# EAGLE design base (EAGLE 9.1.2)
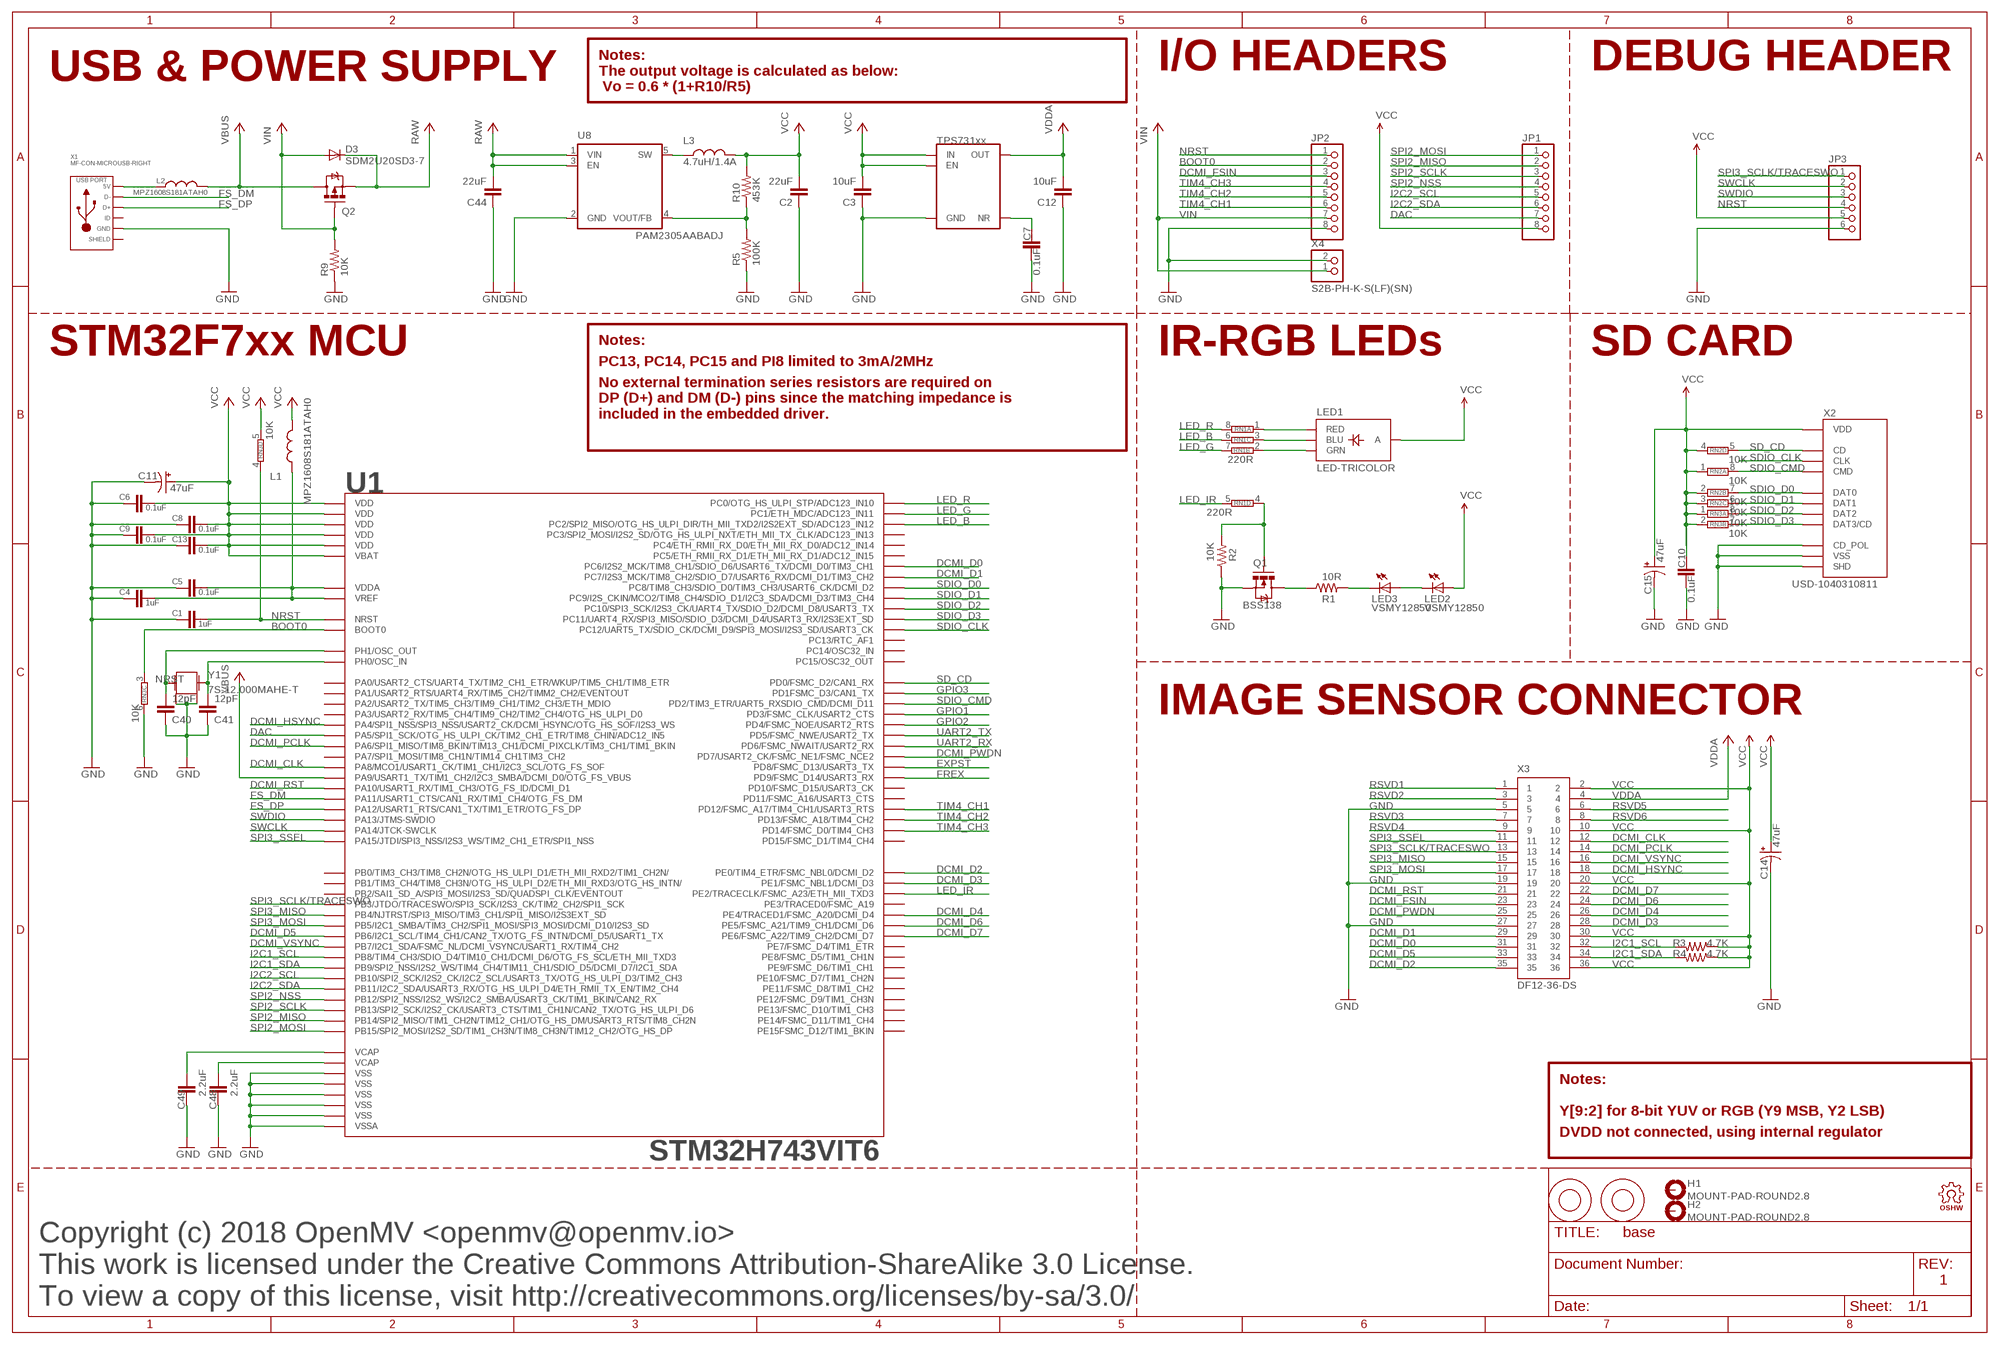
[diagram p0: schematic, sheet 1]

## Parts
C1  1uF  CAP0603-CAP  [0603-CAP]
C2  22uF  CAP0805  [0805]
C3  10uF  CAP0805  [0805]
C4  1uF  CAP0603-CAP  [0603-CAP]
C5  0.1uF  CAP0603-CAP  [0603-CAP]
C6  0.1uF  CAP0603-CAP  [0603-CAP]
C7  0.1uF  CAP0603-CAP  [0603-CAP]
C8  0.1uF  CAP0603-CAP  [0603-CAP]
C9  0.1uF  CAP0603-CAP  [0603-CAP]
C10  0.1uF  CAP0603-CAP  [0603-CAP]
C11  47uF  CAP_POL1206  [EIA3216]
C12  10uF  CAP0805  [0805]
C13  0.1uF  CAP0603-CAP  [0603-CAP]
C14  47uF  CAP_POL1206  [EIA3216]
C15  47uF  CAP_POL1206  [EIA3216]
C40  12pF  CAP0603-CAP  [0603-CAP]
C41  12pF  CAP0603-CAP  [0603-CAP]
C44  22uF  CAP0805  [0805]
C48  2.2uF  CAP0603-CAP  [0603-CAP]
C49  2.2uF  CAP0603-CAP  [0603-CAP]
D3  SDM2U20SD3-7  DIODESOD  [SOD-323]
H1  MOUNT-PAD-ROUND2.8  [2,8-PAD]
H2  MOUNT-PAD-ROUND2.8  [2,8-PAD]
JP1  PINHD-1X8  [1X08]
JP2  PINHD-1X8  [1X08]
JP3  PINHD-1X6  [1X06]
L1  MPZ1608S181ATAH0  INDUCTOR0603  [0603]
L2  MPZ1608S181ATAH0  INDUCTOR0603  [0603]
L3  4.7uH/1.4A  INDUCTOR1007  [1007]
LED1  LED-TRICOLOR  [LED-TRICOLOR-SMD-MF]
LED2  VSMY12850  LED1206  [LED-1206]
LED3  VSMY12850  LED1206  [LED-1206]
LOGO1  OSHW_LOGO_FILLX0100-NT  [OSHW_FILLX100_NOTEXT]
M1  9774030243R  9774030151R  [9774030151R]
M2  9774030243R  9774030151R  [9774030151R]
Q1  BSS138  MOSFET-NCHANNELSMD  [SOT23-3]
Q2  Si2301BDS  MOSFET-PCHANNELSMD  [SOT23-3]
R1  10R  RESISTOR0603-RES  [0603-RES]
R2  10K  RESISTOR0603-RES  [0603-RES]
R3  4.7K  RESISTOR0603-RES  [0603-RES]
R4  4.7K  RESISTOR0603-RES  [0603-RES]
R5  100K  RESISTOR0603-RES  [0603-RES]
R9  10K  RESISTOR0603-RES  [0603-RES]
R10  453K  RESISTOR0603-RES  [0603-RES]
RN1  220R  4R-NEXBV8V  [EXBV8V]
RN2  10K  4R-NEXBV8V  [EXBV8V]
RN3  10K  4R-NEXBV8V  [EXBV8V]
U1  STM32H743VIT6  STM32F746LQFP100  [LQFP100]
U5  TPS731XX  [SOT23-5]
U8  PAM2305AABADJ  PAM2305AAB330  [TSOT25]
X1  MF-CON-MICROUSB-RIGHT  USB_MICRO_RIGHT  [MICROUSB-RIGHT]
X2  USD-1040310811  [1040310811]
X3  DF12-36-DS  [DF12-36-DS]
X4  S2B-PH-K-S(LF)(SN)  JST_2PIN-THM-RA  [JST-PH-2-THM-RA]
Y1  7S-12.000MAHE-T  CRYSTAL2.5X2.0  [CRYSTAL-2.5X2.0]

## Nets
BOOT0: JP2.2 RN3.3 U1.94(BOOT0)
DAC: JP1.7 U1.29(PA5/SPI1_SCK/OTG_HS_ULPI_CK/TIM2_CH1_ETR/TIM8_CHIN/ADC12_IN5)
DCMI_CLK: U1.67(PA8/MCO1/USART1_CK/TIM1_CH1/I2C3_SCL/OTG_FS_SOF) X3.12
DCMI_D0: U1.63(PC6/I2S2_MCK/TIM8_CH1/SDIO_D6/USART6_TX/DCMI_D0/TIM3_CH1) X3.31
DCMI_D1: U1.64(PC7/I2S3_MCK/TIM8_CH2/SDIO_D7/USART6_RX/DCMI_D1/TIM3_CH2) X3.29
DCMI_D2: U1.97(PE0/TIM4_ETR/FSMC_NBL0/DCMI_D2) X3.35
DCMI_D3: U1.98(PE1/FSMC_NBL1/DCMI_D3) X3.28
DCMI_D4: U1.3(PE4/TRACED1/FSMC_A20/DCMI_D4) X3.26
DCMI_D5: U1.92(PB6/I2C1_SCL/TIM4_CH1/CAN2_TX/OTG_FS_INTN/DCMI_D5/USART1_TX) X3.33
DCMI_D6: U1.4(PE5/FSMC_A21/TIM9_CH1/DCMI_D6) X3.24
DCMI_D7: U1.5(PE6/FSMC_A22/TIM9_CH2/DCMI_D7) X3.22
DCMI_FSIN: JP2.3 X3.23
DCMI_HSYNC: U1.28(PA4/SPI1_NSS/SPI3_NSS/USART2_CK/DCMI_HSYNC/OTG_HS_SOF/I2S3_WS) X3.18
DCMI_PCLK: U1.30(PA6/SPI1_MISO/TIM8_BKIN/TIM13_CH1/DCMI_PIXCLK/TIM3_CH1/TIM1_BKIN) X3.14
DCMI_PWDN: U1.88(PD7/USART2_CK/FSMC_NE1/FSMC_NCE2) X3.25
DCMI_RST: U1.69(PA10/USART1_RX/TIM1_CH3/OTG_FS_ID/DCMI_D1) X3.21
DCMI_VSYNC: U1.93(PB7/I2C1_SDA/FSMC_NL/DCMI_VSYNC/USART1_RX/TIM4_CH2) X3.16
EXPST: U1.55(PD8/FSMC_D13/USART3_TX)
FREX: U1.56(PD9/FSMC_D14/USART3_RX)
FS_DM: U1.70(PA11/USART1_CTS/CAN1_RX/TIM1_CH4/OTG_FS_DM) X1.2(D-)
FS_DP: U1.71(PA12/USART1_RTS/CAN1_TX/TIM1_ETR/OTG_FS_DP) X1.3(D+)
GND: C1.2 C2.1 C3.1 C4.2 C5.2 C6.2 C7.2 C8.2 C9.2 C10.2 C11.C(-) C12.1 C13.2 C14.C(-) C15.C(-) C40.1 C41.1 C44.1 C48.2 C49.2 JP2.8 JP3.6 Q1.2(S) R2.1 R5.1 R9.1 RN3.6 U1.10(VSS) U1.19(VSSA) U1.26(VSS) U1.49(VSS) U1.74(VSS) U1.99(VSS) U5.2(GND) U8.2(GND) X1.5(GND) X2.CD$2(CD_POL) X2.G$1(SHD) X2.G$2(SHD) X2.G$3(SHD) X2.G$4(SHD) X2.P$6(VSS) X3.5 X3.19 X3.27 X4.2 Y1.2 Y1.4
GPIO1: U1.84(PD3/FSMC_CLK/USART2_CTS)
GPIO2: U1.85(PD4/FSMC_NOE/USART2_RTS)
GPIO3: U1.82(PD1FSMC_D3/CAN1_TX)
I2C1_SCL: R3.2 U1.95(PB8/TIM4_CH3/SDIO_D4/TIM10_CH1/DCMI_D6/OTG_FS_SCL/ETH_MII_TXD3) X3.32
I2C1_SDA: R4.2 U1.96(PB9/SPI2_NSS/I2S2_WS/TIM4_CH4/TIM11_CH1/SDIO_D5/DCMI_D7/I2C1_SDA) X3.34
I2C2_SCL: JP1.5 U1.46(PB10/SPI2_SCK/I2S2_CK/I2C2_SCL/USART3_TX/OTG_HS_ULPI_D3/TIM2_CH3)
I2C2_SDA: JP1.6 U1.47(PB11/I2C2_SDA/USART3_RX/OTG_HS_ULPI_D4/ETH_RMII_TX_EN/TIM2_CH4)
LED_B: RN1.6 U1.17(PC2/SPI2_MISO/OTG_HS_ULPI_DIR/TH_MII_TXD2/I2S2EXT_SD/ADC123_IN12)
LED_G: RN1.7 U1.16(PC1/ETH_MDC/ADC123_IN11)
LED_IR: RN1.5 U1.1(PE2/TRACECLK/FSMC_A23/ETH_MII_TXD3)
LED_R: RN1.8 U1.15(PC0/OTG_HS_ULPI_STP/ADC123_IN10)
N$2: C40.2 U1.13(PH1/OSC_OUT) Y1.3
N$4: C41.2 U1.12(PH0/OSC_IN) Y1.1
N$5: Q1.1(G) R2.2 RN1.4
N$6: LED1.B(BLU) RN1.3
N$7: L2.1 X1.1(5V)
N$8: LED1.R(RED) RN1.1
N$9: LED1.G(GRN) RN1.2
N$10: LED3.C R1.2
N$11: C7.1 U5.4(NR)
N$12: C4.1 C5.1 L1.1 U1.20(VREF) U1.21(VDDA)
N$13: R5.2 R10.1 U8.4(VOUT/FB)
N$14: Q1.3(D) R1.1
N$17: LED2.C LED3.A
NRST: C1.1 JP2.1 JP3.4 RN3.4 U1.14(NRST)
RAW: C44.2 D3.1(C) Q2.2(S) U8.1(VIN) U8.3(EN)
RSVD1: X3.1
RSVD2: X3.3
RSVD3: X3.7
RSVD4: X3.9
RSVD5: X3.6
RSVD6: X3.8
SD_CD: RN2.5 U1.81(PD0/FSMC_D2/CAN1_RX) X2.CD$1(CD)
SDIO_CLK: U1.80(PC12/UART5_TX/SDIO_CK/DCMI_D9/SPI3_MOSI/I2S3_SD/USART3_CK) X2.P$5(CLK)
SDIO_CMD: RN2.8 U1.83(PD2/TIM3_ETR/UART5_RXSDIO_CMD/DCMI_D11) X2.P$3(CMD)
SDIO_D0: RN2.7 U1.65(PC8/TIM8_CH3/SDIO_D0/TIM3_CH3/USART6_CK/DCMI_D2) X2.P$7(DAT0)
SDIO_D1: RN2.6 U1.66(PC9/I2S_CKIN/MCO2/TIM8_CH4/SDIO_D1/I2C3_SDA/DCMI_D3/TIM3_CH4) X2.P$8(DAT1)
SDIO_D2: RN3.8 U1.78(PC10/SPI3_SCK/I2S3_CK/UART4_TX/SDIO_D2/DCMI_D8/USART3_TX) X2.P$1(DAT2)
SDIO_D3: RN3.7 U1.79(PC11/UART4_RX/SPI3_MISO/SDIO_D3/DCMI_D4/USART3_RX/I2S3EXT_SD) X2.P$2(DAT3/CD)
SPI2_MISO: JP1.2 U1.53(PB14/SPI2_MISO/TIM1_CH2N/TIM12_CH1/OTG_HS_DM/USART3_RTS/TIM8_CH2N)
SPI2_MOSI: JP1.1 U1.54(PB15/SPI2_MOSI/I2S2_SD/TIM1_CH3N/TIM8_CH3N/TIM12_CH2/OTG_HS_DP)
SPI2_NSS: JP1.4 U1.51(PB12/SPI2_NSS/I2S2_WS/I2C2_SMBA/USART3_CK/TIM1_BKIN/CAN2_RX)
SPI2_SCLK: JP1.3 U1.52(PB13/SPI2_SCK/I2S2_CK/USART3_CTS/TIM1_CH1N/CAN2_TX/OTG_HS_ULPI_D6)
SPI3_MISO: U1.90(PB4/NJTRST/SPI3_MISO/TIM3_CH1/SPI1_MISO/I2S3EXT_SD) X3.15
SPI3_MOSI: U1.91(PB5/I2C1_SMBA/TIM3_CH2/SPI1_MOSI/SPI3_MOSI/DCMI_D10/I2S3_SD) X3.17
SPI3_SCLK/TRACESWO: JP3.1 U1.89(PB3/JTDO/TRACESWO/SPI3_SCK/I2S3_CK/TIM2_CH2/SPI1_SCK) X3.13
SPI3_SSEL: U1.77(PA15/JTDI/SPI3_NSS/I2S3_WS/TIM2_CH1_ETR/SPI1_NSS) X3.11
SW: L3.1 U8.5(SW)
SWCLK: JP3.2 U1.76(PA14/JTCK-SWCLK)
SWDIO: JP3.3 U1.72(PA13/JTMS-SWDIO)
TIM4_CH1: JP2.6 U1.59(PD12/FSMC_A17/TIM4_CH1/USART3_RTS)
TIM4_CH2: JP2.5 U1.60(PD13/FSMC_A18/TIM4_CH2)
TIM4_CH3: JP2.4 U1.61(PD14/FSMC_D0/TIM4_CH3)
UART2_RX: U1.87(PD6/FSMC_NWAIT/USART2_RX)
UART2_TX: U1.86(PD5/FSMC_NWE/USART2_TX)
VBUS: L2.2 Q2.3(D) U1.68(PA9/USART1_TX/TIM1_CH2/I2C3_SMBA/DCMI_D0/OTG_FS_VBUS)
VCAP1: C49.1 U1.48(VCAP)
VCAP2: C48.1 U1.73(VCAP)
VCC: C2.2 C3.2 C6.1 C8.1 C9.1 C10.1 C11.A(+) C13.1 C14.A(+) C15.A(+) JP1.8 JP3.5 L1.2 L3.2 LED1.A LED2.A R3.1 R4.1 R10.2 RN2.1 RN2.2 RN2.3 RN2.4 RN3.1 RN3.2 RN3.5 U1.6(VBAT) U1.11(VDD) U1.27(VDD) U1.50(VDD) U1.75(VDD) U1.100(VDD) U5.1(IN) U5.3(EN) X2.P$4(VDD) X3.2 X3.10 X3.20 X3.30 X3.36
VDDA: C12.2 U5.5(OUT) X3.4
VIN: D3.2(A) JP2.7 Q2.1(G) R9.2 X4.1
Unconnected: H1.B2,8(MOUNT) H2.B2,8(MOUNT) U1.2(PE3/TRACED0/FSMC_A19) U1.7(PC13/RTC_AF1) U1.8(PC14/OSC32_IN) U1.9(PC15/OSC32_OUT) U1.18(PC3/SPI2_MOSI/I2S2_SD/OTG_HS_ULPI_NXT/ETH_MII_TX_CLK/ADC123_IN13) U1.22(PA0/USART2_CTS/UART4_TX/TIM2_CH1_ETR/WKUP/TIM5_CH1/TIM8_ETR) U1.23(PA1/USART2_RTS/UART4_RX/TIM5_CH2/TIMM2_CH2/EVENTOUT) U1.24(PA2/USART2_TX/TIM5_CH3/TIM9_CH1/TIM2_CH3/ETH_MDIO) U1.25(PA3/USART2_RX/TIM5_CH4/TIM9_CH2/TIM2_CH4/OTG_HS_ULPI_D0) U1.31(PA7/SPI1_MOSI/TIM8_CH1N/TIM14_CH1TIM3_CH2) U1.32(PC4/ETH_RMII_RX_D0/ETH_MII_RX_D0/ADC12_IN14) U1.33(PC5/ETH_RMII_RX_D1/ETH_MII_RX_D1/ADC12_IN15) U1.34(PB0/TIM3_CH3/TIM8_CH2N/OTG_HS_ULPI_D1/ETH_MII_RXD2/TIM1_CH2N/) U1.35(PB1/TIM3_CH4/TIM8_CH3N/OTG_HS_ULPI_D2/ETH_MII_RXD3/OTG_HS_INTN/) U1.36(PB2/SAI1_SD_A/SPI3_MOSI/I2S3_SD/QUADSPI_CLK/EVENTOUT) U1.37(PE7/FSMC_D4/TIM1_ETR) U1.38(PE8/FSMC_D5/TIM1_CH1N) U1.39(PE9/FSMC_D6/TIM1_CH1) U1.40(PE10/FSMC_D7/TIM1_CH2N) U1.41(PE11/FSMC_D8/TIM1_CH2) U1.42(PE12/FSMC_D9/TIM1_CH3N) U1.43(PE13/FSMC_D10/TIM1_CH3) U1.44(PE14/FSMC_D11/TIM1_CH4) U1.45(PE15FSMC_D12/TIM1_BKIN) U1.57(PD10/FSMC_D15/USART3_CK) U1.58(PD11/FSMC_A16/USART3_CTS) U1.62(PD15/FSMC_D1/TIM4_CH4) X1.4(ID) X1.S1(SLD) X1.S2(SLD) X1.S3(SLD) X1.S4(SLD) X1.S5(SLD) X1.S6(SLD)

## Notes on the sheet
- Notes:
- USB & POWER SUPPLY | I/O HEADERS | DEBUG HEADER
- The output voltage is calculated as below:
   Vo = 0.6 * (1+R10/R5)
- Notes:
- STM32F7xx MCU | IR-RGB LEDs | SD CARD
- PC13, PC14, PC15 and PI8 limited to 3mA/2MHz
- No external termination series resistors are required on
  DP (D+) and DM (D-) pins since the matching impedance is
  included in the embedded driver.
- IMAGE SENSOR CONNECTOR
- Notes:
- Y[9:2] for 8-bit YUV or RGB (Y9 MSB, Y2 LSB)
- DVDD not connected, using internal regulator
- Copyright (c) 2018 OpenMV <openmv@openmv.io>
- This work is licensed under the Creative Commons Attribution-ShareAlike 3.0 License.
- 1
- To view a copy of this license, visit http://creativecommons.org/licenses/by-sa/3.0/

## Library data of the parts
C1-C10 C12 C13 C40 C41 C44 C48 C49 = sfe:CAP: Capacitor Standard 0603 ceramic capacitor, and 0.1" leaded capacitor.
C11 C14 C15 = sfe:CAP_POL: Capacitor Polarized These are standard SMD and PTH capacitors. Normally 10uF, 47uF, and 100uF in electrolytic and tantalum varieties. Always verify the external diameter of the through hole cap, it varies with capacity, voltage, and manufacturer. The EIA devices should be standard.
D3 = sfe:DIODE: Diode These are standard reverse protection diodes and small signal diodes. SMA package can handle up to about 1A. SOD-323 can handle about 200mA. What the SOD-323 package when ordering, there are some mfgs out there that are 5-pin packages.
H1 H2 = holes:MOUNT-PAD-ROUND: MOUNTING PAD, round
JP1 JP2 = pinhead:PINHD-1X8: PIN HEADER
JP3 = pinhead:PINHD-1X6: PIN HEADER
L1-L3 = sfe:INDUCTOR: Inductors Basic Inductor/Choke - 0603 and 1206. Footprints are not proven and vary greatly between part numbers.
LED1 = sfe:LED-TRICOLOR: Tri-Color LED SMD Proven layout and schematic for triple color LED in SMD package - common anode. Spark Fun Electronics SKU : COM-07844
LED2 LED3 = sfe:LED: LEDs Standard schematic elements and footprints for 5mm, 3mm, 1206, and 0603 sized LEDs. 5mm - Spark Fun Electronics SKU : COM-00529 (and others)
LOGO1 = iofault:OSHW_LOGO_FILL
M1 M2 = STANDOFFS:9774030151R
Q1 = sfe:MOSFET-NCHANNEL
Q2 = sfe:MOSFET-PCHANNEL
R1-R5 R9 R10 = sfe:RESISTOR: Resistor Basic schematic elements and footprints for 0603, 1206, and PTH resistors.
RN1-RN3 = resistor-dil:4R-N: Array Chip Resistor Source: RS Component / Phycomp; OC_FARNELL: unknown; OC_NEWARK: unknown
U1 = stm32:STM32F746
U5 = mux:TPS731XX
U8 = regulators:PAM2305AAB330
X1 = MF_Connectors:USB: Library: MF_Connectors Description: 5 Pin USB Connectors. SLD is the shield connection. Usually tied to ground through a small ferrite bead.
X2 = molex:USD-1040310811
X3 = DF12:DF12-36-DS
X4 = adafruit-updated:JST_2PIN: JST 2-Pin Connectors of various flavors SMT-RA (S2B-PH-SM4) 4UConnector #17311 SMT (B2B-PH-SM4) THM-RA (S2B-PH) THM (B2B-PH)
Y1 = mux:CRYSTAL: Crystals Various standard crystals. Proven footprints. Spark Fun Electronics SKU : COM-00534

## Board
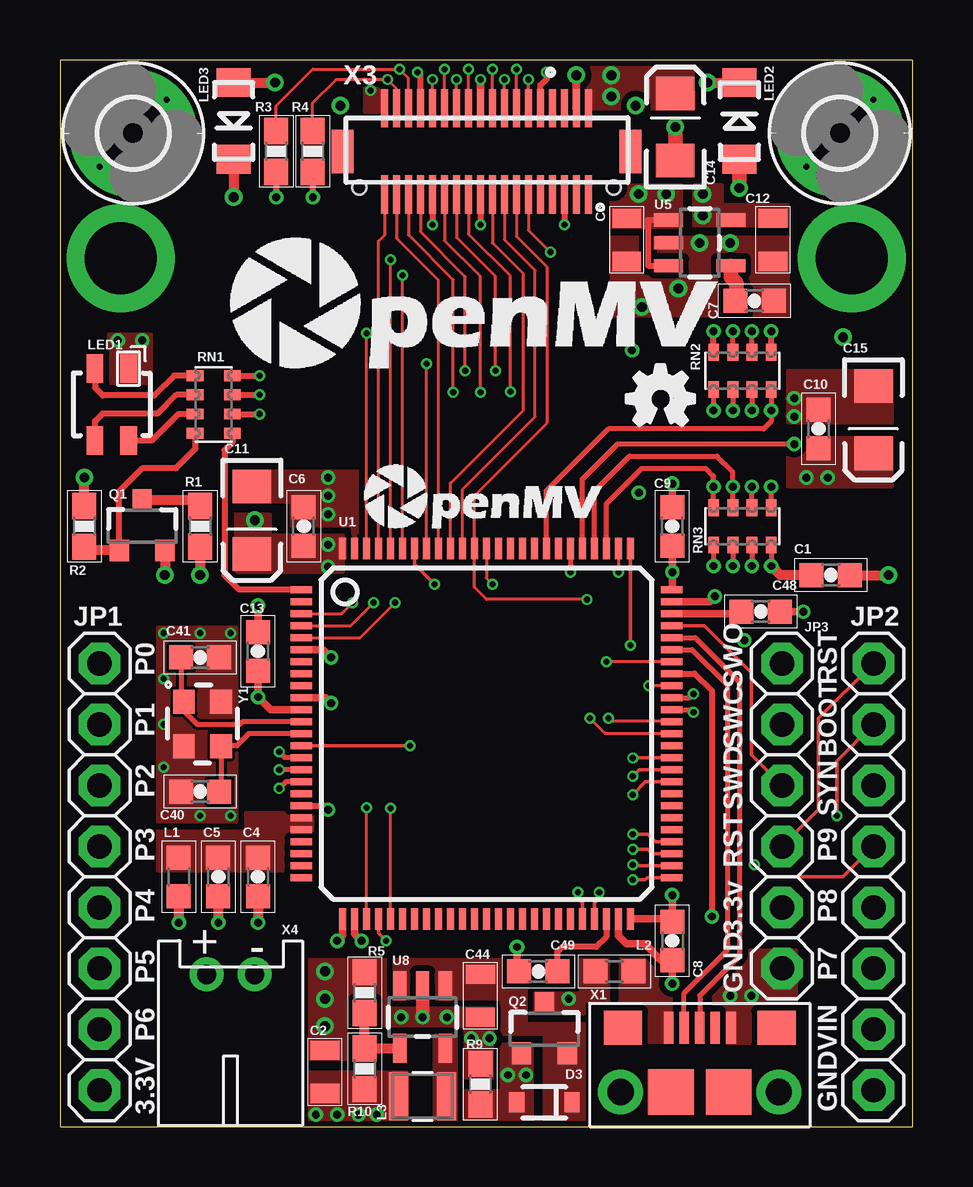
[diagram p1: board, top side]
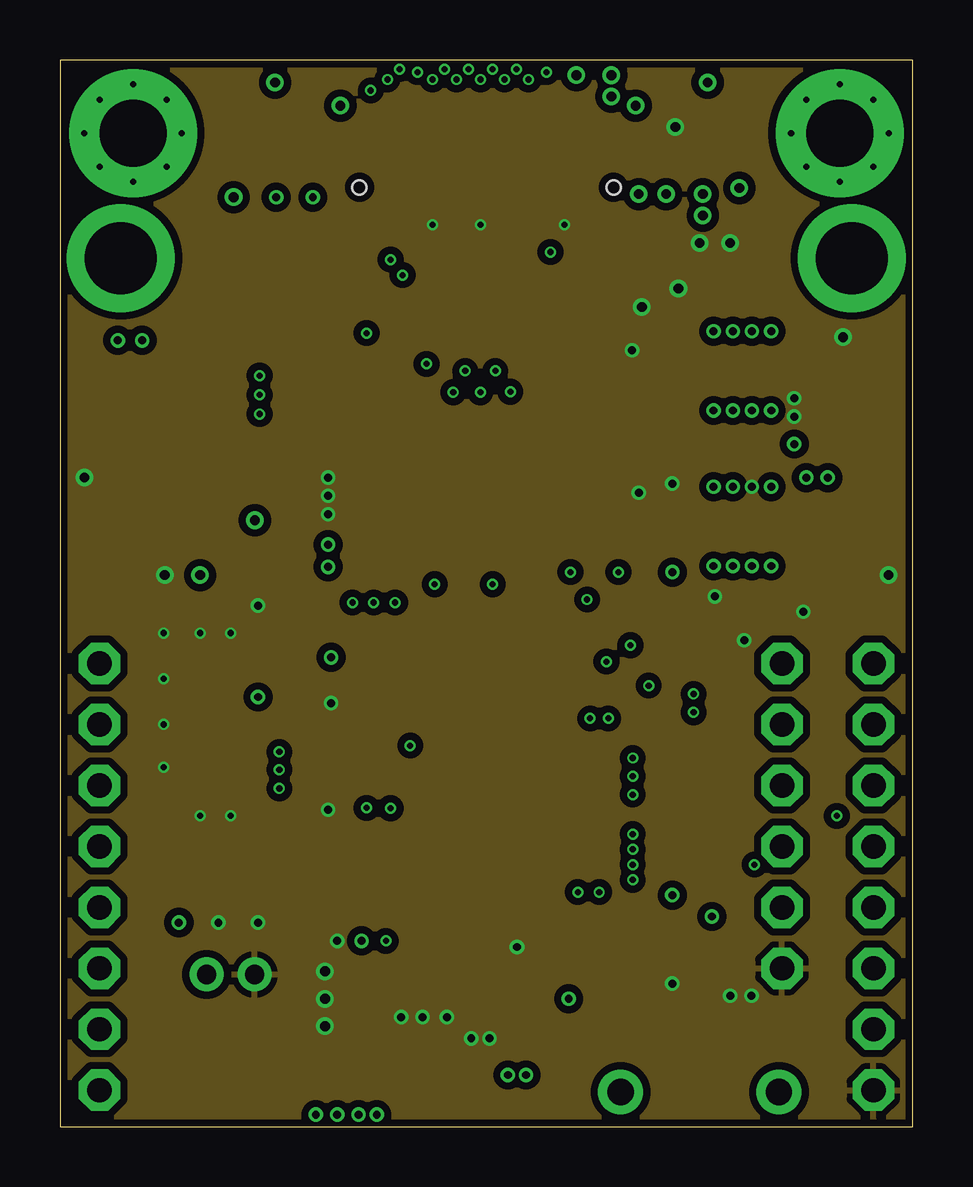
[diagram p2: board, inner layer GND]
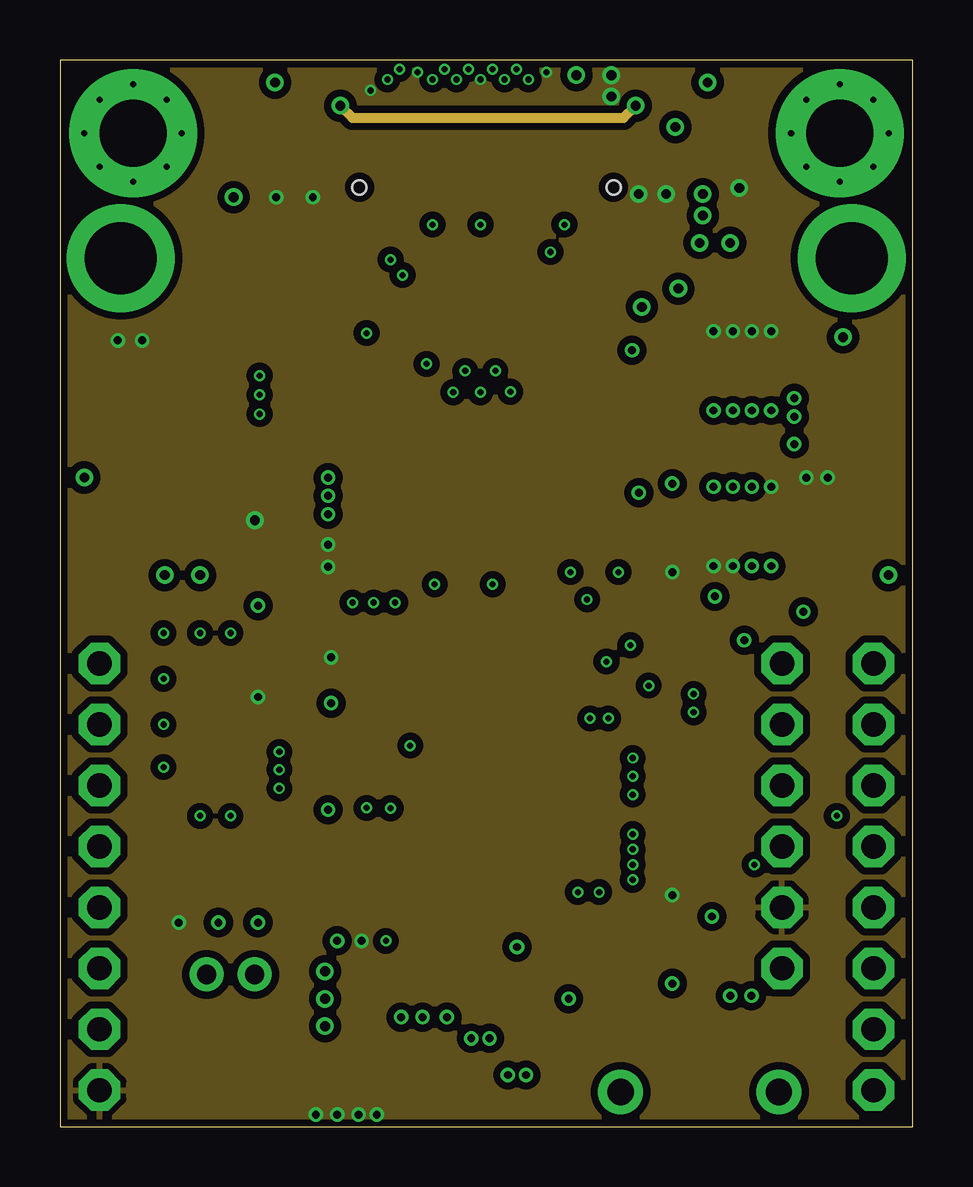
[diagram p3: board, inner layer VCC]
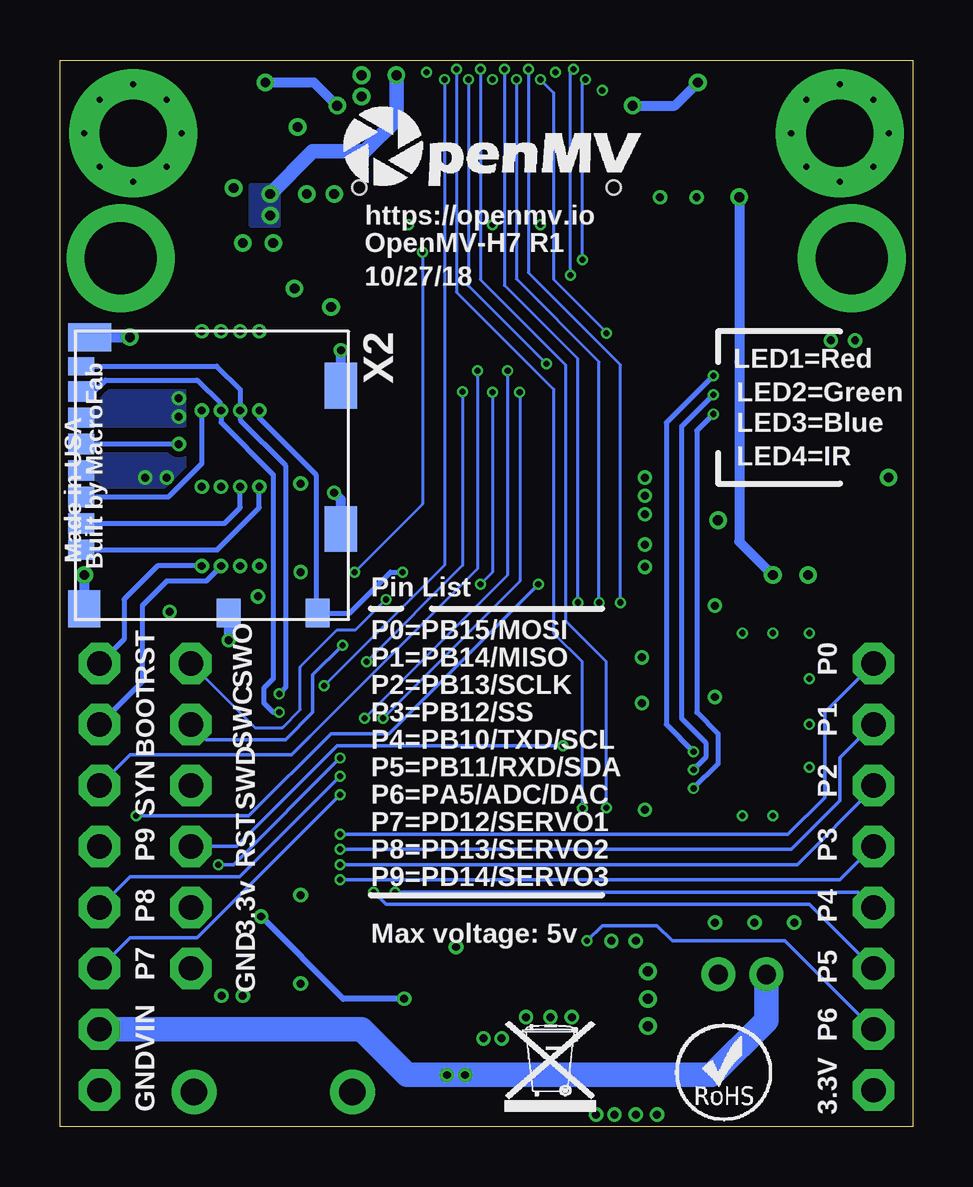
[diagram p4: board, bottom side, seen from below]

Size 35.56 x 44.45 mm. Coordinates in mm from the lower left corner, seen from the top.
Outline: 0,44.45 0,0 35.56,0 35.56,44.45 0,44.45
Copper layers (1*2+15*16): Top 0.035mm / dielectric 1.5mm / GND 0.035mm / dielectric 0.15mm / VCC 0.035mm / dielectric 0.2mm / Bottom 0.035mm
Design rules "default": minimum track width 5mil, minimum drill 10mil, track to track 5mil, track to pad 5mil, pad to pad 5mil, via to via 5mil, smd to smd 5mil, copper to edge 5mil, drill to drill 10mil, minimum pad ring 10mil, minimum via ring 4mil, stop-mask expansion 2mil, vias tented up to drill 30mil, thermal gap 10mil

### Footprints (pad centres in the part's own frame; a part is rotated, then mirrored left to right if it is on the bottom)
0603-CAP = smd 1 x 1: 1 -0.8,0; 2 0.8,0
0805 = smd 0.8 x 1.2: 1 -0.9,0; 2 0.9,0
EIA3216 = smd 1.4 x 1.6: A 1.4,0; C -1.4,0
SOD-323 = smd 0.63 x 0.83: 1 -1.15,0; 2 1.15,0
2,8-PAD = drill 2.8 pad 5.334: B2,8 0,0
1X08 = drill 1.016 octagon: 1 -8.89,0; 2 -6.35,0; 3 -3.81,0; 4 -1.27,0; 5 1.27,0; 6 3.81,0; 7 6.35,0; 8 8.89,0
1X06 = drill 1.016 octagon: 1 -6.35,0; 2 -3.81,0; 3 -1.27,0; 4 1.27,0; 5 3.81,0; 6 6.35,0
0603 = smd 1 x 1: 1 -0.8,0; 2 0.8,0
1007 = smd 2 x 0.8: 1 0,1; 2 0,-1
LED-TRICOLOR-SMD-MF = smd 0.7 x 1.2: A 0.7,1.5; B 0.7,-1.5; G -0.7,-1.5; R -0.7,1.5
LED-1206 = smd 1.2 x 1.4: A -1.6,0; C 1.6,0
9774030151R = drill 3 pad 4.5: P$1 0,0
SOT23-3 = smd 0.8 x 0.9: 1 -0.95,-1; 2 0.95,-1; 3 0,1.1
0603-RES = smd 1.1 x 1: 1 -0.85,0; 2 0.85,0
EXBV8V = smd 0.45 x 0.7: 1 -1.2,-0.775; 2 -0.4,-0.775; 3 0.4,-0.775; 4 1.2,-0.775; 5 1.2,0.775; 6 0.4,0.775; 7 -0.4,0.775; 8 -1.2,0.775
LQFP100 = smd 0.9 x 0.3: 1 -7.72,6; 2 -7.72,5.5; 3 -7.72,5; 4 -7.72,4.5; 5 -7.72,4; 6 -7.72,3.5; 7 -7.72,3; 8 -7.72,2.5; 9 -7.72,2; 10 -7.72,1.5; 11 -7.72,1; 12 -7.72,0.5; 13 -7.72,0; 14 -7.72,-0.5; 15 -7.72,-1; 16 -7.72,-1.5; 17 -7.72,-2; 18 -7.72,-2.5; 19 -7.72,-3; 20 -7.72,-3.5; 21 -7.72,-4; 22 -7.72,-4.5; 23 -7.72,-5; 24 -7.72,-5.5; 25 -7.72,-6; 51 7.72,-6; 52 7.72,-5.5; 53 7.72,-5; 54 7.72,-4.5; 55 7.72,-4; 56 7.72,-3.5; 57 7.72,-3; 58 7.72,-2.5; 59 7.72,-2; 60 7.72,-1.5; 61 7.72,-1; 62 7.72,-0.5; 63 7.72,0; 64 7.72,0.5; 65 7.72,1; 66 7.72,1.5; 67 7.72,2; 68 7.72,2.5; 69 7.72,3; 70 7.72,3.5; 71 7.72,4; 72 7.72,4.5; 73 7.72,5; 74 7.72,5.5; 75 7.72,6 | smd 0.3 x 0.9: 26 -6,-7.72; 27 -5.5,-7.72; 28 -5,-7.72; 29 -4.5,-7.72; 30 -4,-7.72; 31 -3.5,-7.72; 32 -3,-7.72; 33 -2.5,-7.72; 34 -2,-7.72; 35 -1.5,-7.72; 36 -1,-7.72; 37 -0.5,-7.72; 38 0,-7.72; 39 0.5,-7.72; 40 1,-7.72; 41 1.5,-7.72; 42 2,-7.72; 43 2.5,-7.72; 44 3,-7.72; 45 3.5,-7.72; 46 4,-7.72; 47 4.5,-7.72; 48 5,-7.72; 49 5.5,-7.72; 50 6,-7.72; 76 6,7.72; 77 5.5,7.72; 78 5,7.72; 79 4.5,7.72; 80 4,7.72; 81 3.5,7.72; 82 3,7.72; 83 2.5,7.72; 84 2,7.72; 85 1.5,7.72; 86 1,7.72; 87 0.5,7.72; 88 0,7.72; 89 -0.5,7.72; 90 -1,7.72; 91 -1.5,7.72; 92 -2,7.72; 93 -2.5,7.72; 94 -3,7.72; 95 -3.5,7.72; 96 -4,7.72; 97 -4.5,7.72; 98 -5,7.72; 99 -5.5,7.72; 100 -6,7.72
SOT23-5 = smd 0.55 x 1.2: 1 -0.95,-1.3; 2 0,-1.3; 3 0.95,-1.3; 4 0.95,1.3; 5 -0.95,1.3
TSOT25 = smd 0.55 x 1.2: 1 -0.95,-1.3; 2 0,-1.3; 3 0.95,-1.3; 4 0.95,1.3; 5 -0.95,1.3
MICROUSB-RIGHT = smd 0.4 x 1.35: 1 -1.3,1.27; 2 -0.65,1.27; 3 0,1.27; 4 0.65,1.27; 5 1.3,1.27 | drill 1.1: S1 -3.3,-1.405; S2 3.3,-1.405 | smd 1.6 x 1.4: S3 -3.2,1.27; S4 3.2,1.27 | smd 1.9 x 1.9: S5 -1.2,-1.405; S6 1.2,-1.405
1040310811 = smd 1.2 x 1: CD$1 11.74,10.1; CD$2 11.74,6.4 | smd 1.55 x 1.35: G$1 11.565,0.375 | smd 1.17 x 1.8: G$2 0.245,0.6 | smd 1.9 x 1.35: G$3 2.27,11.075; G$4 8.24,11.075 | smd 0.85 x 1.1: P$1 9.105,0.25; P$2 8.005,0.25; P$3 6.905,0.25; P$4 5.805,0.25; P$5 4.705,0.25; P$6 3.605,0.25; P$7 2.505,0.25 | smd 0.75 x 1.1: P$8 1.455,0.25
DF12-36-DS = smd 0.3 x 1.6: 1 4.25,-1.8; 2 4.25,1.8; 3 3.75,-1.8; 4 3.75,1.8; 5 3.25,-1.8; 6 3.25,1.8; 7 2.75,-1.8; 8 2.75,1.8; 9 2.25,-1.8; 10 2.25,1.8; 11 1.75,-1.8; 12 1.75,1.8; 13 1.25,-1.8; 14 1.25,1.8; 15 0.75,-1.8; 16 0.75,1.8; 17 0.25,-1.8; 18 0.25,1.8; 19 -0.25,-1.8; 20 -0.25,1.8; 21 -0.75,-1.8; 22 -0.75,1.8; 23 -1.25,-1.8; 24 -1.25,1.8; 25 -1.75,-1.8; 26 -1.75,1.8; 27 -2.25,-1.8; 28 -2.25,1.8; 29 -2.75,-1.8; 30 -2.75,1.8; 31 -3.25,-1.8; 32 -3.25,1.8; 33 -3.75,-1.8; 34 -3.75,1.8; 35 -4.25,-1.8; 36 -4.25,1.8 | smd 0.9 x 1.8: F1 6,0; F2 -6,0 | hole 0.6: 5.3,-1.5; -5.3,-1.5
JST-PH-2-THM-RA = drill 0.8 pad 1.422: 1 1,0; 2 -1,0
CRYSTAL-2.5X2.0 = smd 1 x 0.9: 1 -0.95,-0.8; 2 0.9,-0.8; 3 0.9,0.75; 4 -0.95,0.75

### Placement (x,y rotation side)
C1  32.13,22.99 0 top
C2  11.05,2.29 270 top
C3  23.62,36.96 90 top
C4  8.26,10.41 270 top
C5  6.6,10.41 270 top
C6  10.16,25.02 90 top
C7  28.96,34.42 0 top
C8  25.53,7.75 270 top
C9  25.53,25.02 90 top
C10  31.62,29.08 90 top
C11  8,25.27 270 top
C12  29.72,36.96 90 top
C13  8.26,19.81 90 top
C14  25.65,41.66 90 top
C15  33.91,29.46 270 top
C40  5.84,13.97 0 top
C41  5.84,19.56 180 top
C44  17.53,5.46 90 top
C48  29.21,21.46 0 top
C49  19.94,6.48 180 top
D3  20.19,1.02 180 top
H1  3.05,41.4 90 top
H2  32.51,41.4 270 top
JP1  1.65,10.41 270 top
JP2  33.91,10.41 270 top
JP3  30.1,12.95 270 top
L1  4.95,10.41 270 top
L2  23.11,6.48 180 top
L3  15.11,1.27 270 top
LED1  2.16,30.1 0 top
LED2  28.32,41.91 90 top
LED3  7.24,41.91 270 top
LOGO1  23.62,29.21 0 top
M1  2.54,36.2 0 top
M2  33.02,36.2 0 top
Q1  3.43,25.02 0 top
Q2  20.19,4.06 0 top
R1  5.84,25.02 270 top
R2  1.02,25.02 270 top
R3  9.02,40.64 90 top
R4  10.54,40.64 90 top
R5  12.7,5.59 270 top
R9  17.53,1.78 270 top
R10  12.7,2.41 270 top
RN1  6.41,30.1 270 top
RN2  28.45,31.5 180 top
RN3  28.45,25.02 0 top
U1  17.78,16.38 0 top
U5  26.67,36.83 270 top
U8  15.11,4.57 180 top
U$1  [WEEE]  17.02,0.64 0 bottom
U$2  [ROHS]  9.91,0.25 0 bottom
U$3  [OMV-LOGO]  23.88,38.99 0 bottom
U$4  [OMV-LOGO-SMALL]  12.57,24.77 0 top
U$6  [OMV-LOGO-BIG]  7.11,31.62 0 top
X1  26.67,2.86 0 top
X2  34.92,33.15 270 bottom
X3  17.78,40.64 0 top
X4  7.11,6.35 180 top
Y1  5.97,16.76 270 top

### Tracks (layer width: path | path; a pad name or v marks a point on that pad's centre or on a via)
BOOT0  (via drill 0.25, 0.33)
  Top 0.152: v32.38,12.95 32.38,15.24 JP2.2 | U1.94 14.78,23.45 v15.62,22.61
  Top 0.203: RN3.3 v28.85,23.37
  Bottom 0.152: v32.38,12.95 27.69,12.95 24.26,16.38 21.84,16.38 v15.62,22.61
  Bottom 0.203: JP2.2 32.13,18.54 32.13,21.72 31.11,22.73 29.46,22.73 28.85,23.35 v28.85,23.37
DAC  (via drill 0.25)
  Top 0.152: U1.29 13.28,8.06 v13.59,7.75
  Bottom 0.152: v13.59,7.75 12.95,8.38 10.67,8.38 10.03,7.75 5.33,7.75 JP1.7
DCMI_CLK  (via drill 0.25)
  Top 0.127: X3.12 v19.53,43.64 | U1.67 v24.54,18.38
  Bottom 0.127: v19.53,43.64 19.53,23.4 v24.54,18.38
DCMI_D0  (via drill 0.25)
  Top 0.127: X3.31 14.53,37.16 16.39,35.29 v16.39,30.61 | U1.63 22.73,16.38 v22.1,17.02
  Bottom 0.127: v22.1,17.02 16.38,22.73 16.38,30.59 v16.39,30.61
DCMI_D1  (via drill 0.25)
  Top 0.127: v16.89,31.5 16.89,35.43 15.03,37.29 X3.29 | U1.64 22.99,16.89 v22.86,17.02
  Top 0.152: U1.64 arc-90 U1.64
  Bottom 0.127: v16.89,31.5 16.89,22.98 v22.86,17.02
DCMI_D2
  Top 0.127: U1.97 13.28,36.9 13.53,37.15 X3.35
DCMI_D3  (via drill 0.25)
  Top 0.127: U1.98 v12.78,33.07 | X3.28 v15.53,43.64
  Bottom 0.127: v12.78,33.07 12.78,33.1 14.99,35.31 14.99,43.09 v15.53,43.64
DCMI_D4  (via drill 0.25)
  Top 0.127: U1.3 11.73,21.38 v12.19,21.84 | X3.26 v16.03,44.07
  Bottom 0.127: v16.03,44.07 16.03,35.59 12.19,31.75 v12.19,21.84
DCMI_D5
  Top 0.127: U1.92 15.78,35.27 14.03,37.02 X3.33
DCMI_D6  (via drill 0.25)
  Top 0.127: U1.4 12.12,20.88 v13.08,21.84 | X3.24 v16.53,43.64
  Bottom 0.127: v16.53,43.64 16.53,35.33 13.08,31.88 v13.08,21.84
DCMI_D7  (via drill 0.25)
  Top 0.127: U1.5 12.51,20.38 v13.97,21.84 | X3.22 v17.03,44.07
  Bottom 0.127: v17.03,44.07 17.03,35.06 13.97,32 v13.97,21.84
DCMI_FSIN  (via drill 0.25)
  Top 0.127: X3.23 16.53,37.06 18.15,35.45 v18.15,31.5
  Bottom 0.127: v18.15,31.5 18.15,23.25 25.15,16.26
  Bottom 0.152: 25.15,16.26 25.91,15.49 32.64,15.49 JP2.3
DCMI_HSYNC  (via drill 0.25)
  Top 0.127: X3.18 v18.03,44.07 | U1.28 v12.78,13.29
  Bottom 0.127: v18.03,44.07 18.03,35.3 14.48,31.75 14.48,21.08 12.78,19.38 v12.78,13.29
DCMI_PCLK  (via drill 0.25)
  Top 0.127: X3.14 v19.03,44.07 | U1.30 v13.78,13.27
  Bottom 0.127: v19.03,44.07 19.03,34.78 14.99,30.73 14.99,20.57 13.78,19.37 v13.78,13.27
DCMI_PWDN  (via drill 0.25)
  Top 0.127: v17.53,30.61 17.53,35.43 16.03,36.93 X3.25 | U1.88 17.78,22.86 v18.03,22.61
  Bottom 0.127: v17.53,30.61 17.53,23.11 v18.03,22.61
DCMI_RST  (via drill 0.25)
  Top 0.127: X3.21 17.03,37.2 18.78,35.45 v18.78,30.63 | U1.69 v22.78,19.38
  Bottom 0.127: v18.78,30.63 18.78,23.39 v22.78,19.38
DCMI_VSYNC  (via drill 0.25)
  Top 0.127: U1.93 v15.28,31.79 | X3.16 v18.53,43.64
  Bottom 0.127: v18.53,43.64 18.53,35.04 v15.28,31.79
FS_DM
  Top 0.203: U1.70 26.34,19.88 27.81,18.41 27.81,7.37 26.02,5.57 X1.2
FS_DP
  Top 0.203: U1.71 26.48,20.38 28.32,18.54 28.32,7.11 26.67,5.46 X1.3
GND  (via drill 0.25, 0.33, 0.33 pad 0.61, 0.41, 0.41 pad 0.61)
  Top 0.203: RN3.6 v28.85,26.67
  Top 0.254: U1.19 11,13.38 v11.18,13.21 | X3.19 v17.53,37.59 | X3.27 v15.53,37.59 | X3.5 v21.03,37.59
  Top 0.305: C48.2 v30.99,21.46 | C9.2 v25.53,26.8 | v25.53,5.97 C8.2 25.06,6.95 24.38,7.62 23.62,7.62 23.28,7.96 U1.49 | U1.10 11.07,17.88 v11.3,17.65 | C13.2 v8.26,21.72 | v19.05,7.49 19.05,6.57 C49.2 | U1.26 11.78,7.97 v11.56,7.75 | U1.74 27.09,21.88 v27.3,22.1
  Top 0.406: C5.2 v6.6,8.51 | C4.2 v8.26,8.51 | R2.1 v1.02,27.05 | Q1.2 v4.38,23 v4.37,22.99 | C1.2 v34.54,22.99
  Top 0.55: U8.2 v15.11,4.57
  Top 0.61: C14.C v25.65,41.66
  Bottom 0.406: X2.CD$2 v28.52,20.27 | X2.G$2 v32.65,32.9 | X2.G$3 v23.85,32.36 | v34.54,22.99 X2.G$1 | X2.G$4 23.85,26.14 v24.13,26.42
  other vias: 4.32,20.57 4.32,16.76 5.84,20.57 7.11,12.95 4.32,18.67 4.32,14.99 30.61,30.35 28.83,5.46 27.94,5.46 5.84,12.95 7.11,20.57 11.18,26.29 11.18,27.05 30.61,29.59 11.18,25.53 14.22,4.57 16.13,4.57 17.91,3.68 17.14,3.68 11.05,5.33 25.78,34.92 27.94,36.83 26.67,36.83 24.26,34.16 11.05,4.19 11.05,6.48
  pour GND (isolate 0.305): 0,0 0,44.45 35.56,44.45 35.56,0
  pour Top (isolate 0.254, no thermals): 30.35,29.34 34.67,29.34 34.67,31.5 30.35,31.5
  pour Top (isolate 0.254, rank 2, no thermals): 7.24,27.3 12.45,27.3 12.45,23.75 12.06,23.75 12.06,25.02 9.65,25.02 9.65,26.04 7.24,26.04
  pour Top (no thermals): 4.06,20.83 7.37,20.83 7.37,12.7 4.06,12.7
  pour Top (isolate 0.254, rank 5, no thermals): 27.27,3.49 27.27,7.36 30.69,7.36 30.69,3.49
  pour Top (isolate 0.254, rank 3, no thermals): 10.41,6.99 18.29,6.99 18.29,2.03 16.89,2.03 16.89,3.05 16.89,4.19 11.94,4.19 11.94,2.79 10.41,2.79
  pour Bottom (isolate 0.254, no thermals): 30.35,29.21 34.67,29.21 34.67,30.73 30.35,30.73
  pour Top (isolate 0.254, rank 5, no thermals): 22.99,37.08 30.35,37.08 30.35,33.78 22.99,33.78
I2C1_SCL  (via drill 0.25)
  Top 0.127: U1.95 v14.28,35.49 | X3.32 14.53,43.69 v14.15,44.07 10.54,44.07 9.02,42.55 R3.2
  Bottom 0.127: v14.28,35.49 14.28,43.94 v14.15,44.07
I2C1_SDA  (via drill 0.25)
  Top 0.127: U1.96 v13.78,36.13 | X3.34 14.03,43.26 v13.65,43.64 11.51,43.64 10.54,42.67 R4.2
  Bottom 0.127: v13.78,36.13 13.78,43.51 v13.65,43.64
I2C2_SCL  (via drill 0.25)
  Top 0.152: v21.59,9.78 21.59,9.53 21.77,9.34 U1.46
  Bottom 0.152: v21.59,9.78 2.29,9.78 JP1.5
I2C2_SDA  (via drill 0.25)
  Top 0.152: v22.48,9.78 22.48,9.53 22.27,9.32 U1.47
  Bottom 0.152: v22.48,9.78 21.97,9.27 4.32,9.27 JP1.6
LED_B  (via drill 0.25)
  Top 0.203: U1.17 9.43,14.38 v9.14,14.1
  Top 0.254: RN1.6 v8.32,29.7
  Bottom 0.203: v9.14,14.1 8.13,15.11 8.13,16.38 9.02,17.27 9.02,29.01 v8.32,29.7
LED_G  (via drill 0.25)
  Top 0.203: U1.16 v9.14,14.88
  Top 0.254: RN1.7 v8.32,30.5
  Bottom 0.203: v9.14,14.88 8.64,15.39 8.64,16 9.65,17.02 9.65,29.17 v8.32,30.5
LED_IR
  Top 0.254: RN1.5 7.19,28.52 6.86,28.19 6.86,22.99 7.46,22.38 U1.1
LED_R  (via drill 0.25)
  Top 0.203: U1.15 9.38,15.38 v9.14,15.62
  Top 0.254: RN1.8 v8.32,31.3
  Bottom 0.203: v9.14,15.62 10.29,16.76 10.29,29.34 v8.32,31.3
N$1  (via drill 0.25)
  other vias: 3.05,43.43
N$2
  Top 0.203: C40.2 arc90 6.72,14.05 Y1.3 6.73,15.88 7.37,15.88 7.87,16.38 U1.13
N$3  (via drill 0.25)
  other vias: 5.08,41.4
N$4
  Top 0.203: C41.2 5.04,17.71 Y1.1 5.17,17.31 5.71,16.76 7.49,16.76 7.62,16.89 U1.12
N$5
  Top 0.254: Q1.1 2.48,26.48 3.43,27.43 4.83,27.43 5.64,28.24 RN1.4
  Top 0.406: Q1.1 1.17,24.02 R2.2
N$6
  Top 0.254: RN1.3 4.93,29.7 3.83,28.6 LED1.B
N$7
  pour Top (isolate 0.254, rank 2, no thermals): 24.64,6.99 23.37,6.99 23.37,3.53 24.77,3.53 25.48,3.53 25.48,6.99
N$8
  Top 0.254: RN1.1 4.76,31.3 3.94,30.48 1.78,30.48 1.46,30.8 LED1.R
N$9
  Top 0.254: RN1.2 4.84,30.5 4.06,29.72 1.78,29.72 1.46,29.4 LED1.G
N$10  (via drill 0.41, 0.41 pad 0.61)
  Top 0.406: LED3.C v7.24,38.73 | R1.2 v5.84,22.99
  Bottom 0.406: v7.24,38.73 7.24,31.88 7.24,24.38 v5.84,22.99
N$11
  Top 0.61: U5.4 27.97,35.4 28.19,35.18 28.19,34.45 C7.1
N$12
  pour Top (isolate 0.254, rank 2, no thermals): 4.06,12.45 7.75,12.45 7.75,13.08 10.54,13.08 10.54,10.67 4.06,10.67
N$13
  Top 0.406: R5.2 R10.1 U8.4
N$14
  Top 0.406: Q1.3 5.59,26.12 R1.1
N$15  (via drill 0.25)
  other vias: 1.02,41.4
N$16  (via drill 0.25)
  other vias: 3.05,39.37
N$17  (via drill 0.41)
  Top 0.406: LED3.A v8.97,43.51 | v27,43.51 LED2.C
  VCC 0.406: v24,42.55 23.5,42.04 12.19,42.04 v11.68,42.55
  Bottom 0.406: v11.68,42.55 9.93,42.55 v8.97,43.51 | v24,42.55 24.97,43.51 v27,43.51
N$18  (via drill 0.25)
  other vias: 4.45,42.8
N$19  (via drill 0.25)
  other vias: 1.65,42.8
N$20  (via drill 0.25)
  other vias: 1.65,40.01
N$21  (via drill 0.25)
  other vias: 4.45,40.01
N$22  (via drill 0.25)
  other vias: 32.51,43.43
N$23  (via drill 0.25)
  other vias: 30.48,41.4
N$24  (via drill 0.25)
  other vias: 34.54,41.4
N$25  (via drill 0.25)
  other vias: 32.51,39.37
N$26  (via drill 0.25)
  other vias: 31.11,42.8
N$27  (via drill 0.25)
  other vias: 31.11,40.01
N$28  (via drill 0.25)
  other vias: 33.91,42.8
N$29  (via drill 0.25)
  other vias: 33.91,40.01
NRST  (via drill 0.25, 0.33)
  Top 0.152: JP2.1 31.62,17.02 31.62,13.21 JP3.4 | U1.14 v14.6,15.88
  Top 0.203: RN3.4 v29.65,23.37
  Top 0.406: C1.1 30.03,22.99 v29.65,23.37
  Bottom 0.152: JP3.4 28.19,11.68 24,15.88 v14.61,15.88 v14.6,15.88
  Bottom 0.203: JP2.1 32.89,20.32 32.89,21.97 31.5,23.37 v29.65,23.37
RAW
  pour Top (isolate 0.254, rank 2, no thermals): 21.84,4.32 21.84,0.25 20.19,0.25 20.19,3.84 18.41,3.84 18.41,5.31 13.94,5.31 13.94,6.99 19.43,6.99 19.43,4.32
SD_CD  (via drill 0.25, 0.33)
  Top 0.203: RN2.5 v27.25,29.84 | U1.81 v21.28,23.11
  Bottom 0.203: v27.25,29.84 27.25,29.53 24.89,27.18 24.89,21.47 X2.CD$1 23.5,21.41 21.79,23.11 v21.28,23.11
SDIO_CLK  (via drill 0.33)
  Top 0.203: U1.80 21.78,26.99 23.24,28.45 v30.61,28.45
  Bottom 0.203: v30.61,28.45 X2.P$5
SDIO_CMD  (via drill 0.33)
  Top 0.203: U1.83 20.28,26.5 22.86,29.08 29.34,29.08 29.65,29.39 v29.65,29.84 RN2.8
  Bottom 0.203: X2.P$3 31.04,26.24 29.65,27.63 v29.65,29.84
SDIO_D0  (via drill 0.25, 0.33)
  Top 0.203: U1.65 26.3,17.38 v26.42,17.27 | RN2.7 v28.85,29.84
  Bottom 0.203: v26.42,17.27 26.67,17.27 27.05,17.65 27.05,18.29 26.67,18.67 26.67,27.18 28.85,29.36 v28.85,29.84 28.85,30.12 29.84,31.11 33.66,31.11 34.13,30.64 X2.P$7
SDIO_D1  (via drill 0.25, 0.33)
  Top 0.203: RN2.6 v28.05,29.84 | U1.66 26.27,17.88 v26.42,18.03
  Bottom 0.203: v26.42,18.03 26.16,18.29 26.16,27.56 28.05,29.45 v28.05,29.84 RN2.6 29.02,31.69 X2.P$8
SDIO_D2  (via drill 0.33)
  Top 0.203: U1.78 22.78,25.95 24.26,27.43 26.92,27.43 27.25,27.11 v27.25,26.67 RN3.8
  Bottom 0.203: X2.P$1 29,24.04 RN3.8 v27.25,26.67
SDIO_D3  (via drill 0.33)
  Top 0.203: U1.79 22.28,26.47 23.75,27.94 27.39,27.94 28.05,27.29 v28.05,26.67 RN3.7
  Bottom 0.203: X2.P$2 28.7,25.14 RN3.7 v28.05,26.67
SPI2_MISO  (via drill 0.25)
  Top 0.152: U1.53 24.68,11.38 24.51,11.56 v23.88,11.56
  Bottom 0.152: v23.88,11.56 5.08,11.56 3.05,13.59 3.05,15.37 JP1.2
SPI2_MOSI  (via drill 0.25)
  Top 0.152: U1.54 24.82,11.88 24.51,12.19 v23.88,12.19
  Bottom 0.152: v23.88,12.19 5.21,12.19 3.68,13.72 3.68,17.27 JP1.1
SPI2_NSS  (via drill 0.25)
  Top 0.152: U1.51 24.48,10.38 24.38,10.29 v23.88,10.29
  Bottom 0.152: v23.88,10.29 3.05,10.29 2.86,10.48 JP1.4
SPI2_SCLK  (via drill 0.25)
  Top 0.152: U1.52 23.91,10.88 v23.88,10.92
  Bottom 0.152: v23.88,10.92 4.83,10.92 1.65,14.1 JP1.3
SPI3_MISO
  Top 0.127: U1.90 16.78,26.56 19.81,29.59 19.81,35.69 18.53,36.97 X3.15
SPI3_MOSI
  Top 0.127: U1.91 16.28,26.82 19.3,29.84 19.3,35.56 18.03,36.83 X3.17
SPI3_SCLK/TRACESWO  (via drill 0.25)
  Top 0.127: X3.13 19.03,37.1 20.32,35.81 20.32,29.34 17.28,26.3 17.28,25.27 U1.89 17.28,22.47 17.78,21.97 v21.97,21.97
  Bottom 0.127: JP3.1 27.43,16.64 26.29,16.64 25.54,17.39 25.54,19.16 24,20.7 23.24,20.7 v21.97,21.97
SPI3_SSEL  (via drill 0.25)
  Top 0.127: U1.77 v23.28,23.11 | X3.11 19.53,37.37 v20.45,36.45
  Bottom 0.127: v23.28,23.11 20.45,25.95 v20.45,36.45
SW
  pour Top (isolate 0.254, no thermals): 15.62,3.81 16.51,3.81 16.51,0.25 15.62,0.25
SWCLK  (via drill 0.25)
  Top 0.152: U1.76 v23.78,20.07
  Bottom 0.152: v23.78,20.07 25.02,18.83 25.02,17.27 26.16,16.13 29.46,16.13 JP3.2
SWDIO
  Top 0.152: U1.72 26.87,20.88 28.83,18.92 28.83,15.49 JP3.3
TIM4_CH1  (via drill 0.25)
  Top 0.152: U1.59 24.42,14.38 v23.88,13.84
  Bottom 0.152: JP2.6 32.64,7.87 29.84,7.87 v23.88,13.84
TIM4_CH2  (via drill 0.25)
  Top 0.152: U1.60 24.15,14.88 v23.88,14.61
  Bottom 0.152: JP2.5 32.64,10.41 28.07,10.41 v23.88,14.61
TIM4_CH3  (via drill 0.25)
  Top 0.152: JP2.4 32.64,10.41 29.46,10.41 v28.96,10.92 | v23.88,15.37 24,15.37 25.48,15.37 U1.61
  Bottom 0.152: v23.88,15.37 28.32,10.92 v28.96,10.92
VBUS  (via drill 0.33)
  Top 0.254: U1.68 26.46,18.88 27.18,18.16 v27.18,8.76
  Bottom 0.254: v21.21,5.33 23.75,5.33 v27.18,8.76
  pour Top (isolate 0.254, rank 3, no thermals): 19.81,5.59 21.72,5.59 21.72,6.99 22.86,6.99 22.86,5.21 21.84,5.21 21.84,4.7 19.81,4.7
VCAP1
  Top 0.254: C49.1 20.74,7.28 20.95,7.49 22.35,7.49 22.78,7.92 U1.48
VCAP2
  Top 0.305: U1.73 28.33,21.38 C48.1
VCC  (via drill 0.25, 0.33, 0.33 pad 0.61, 0.41)
  Top 0.203: RN3.2 v28.05,23.37 | RN3.1 v27.25,23.37 | RN3.5 v29.65,26.67 | RN2.2 v28.85,33.15 | RN2.3 v28.05,33.15
  Top 0.254: RN2.4 v27.25,33.15 | RN2.1 v29.65,33.15 | R4.1 v10.54,38.73 | R3.1 v9.02,38.73 | X3.30 15.03,43.81 v14.9,43.94 | X3.10 20.03,43.4 20.28,43.65 v20.28,43.94 | U5.3 24.51,35.88 24.51,37.78 U5.1
  Top 0.305: U1.75 25.53,22.41 v25.53,23.11 C9.1 | U1.11 8.78,17.38 v8.26,17.91 C13.1 | U1.50 25.41,8.66 C8.1 v25.53,9.65 | U1.6 10.98,19.88 v11.3,19.56 | U1.27 12.28,8.04 v12.57,7.75 | X3.20 v17.53,43.64
  Top 0.406: L1.2 v4.95,8.51
  Top 0.61: LED2.A v28.32,39.12
  other vias: 11.18,24.26 3.43,32.77 11.18,23.33 2.41,32.77 8.13,25.27 25.27,38.86 24.13,38.86 22.99,43.81 22.99,42.93 31.11,27.05 32,27.05 12.95,43.18 13.21,0.51 12.45,0.51 11.56,0.51 10.67,0.51
  pour VCC (isolate 0.305): 0.38,0.38 0.38,44.07 35.18,44.07 35.18,0.38
  pour Top (isolate 0.254, no thermals): 30.35,26.67 34.67,26.67 34.67,28.7 30.35,28.7
  pour Top (isolate 0.254, no thermals): 7.24,25.53 8.76,25.53 8.76,24.64 11.81,24.64 11.81,23.11 7.24,23.11
  pour Top (isolate 0.254, no thermals): 2.03,33.02 2.03,30.99 3.81,30.99 3.81,33.02
  pour Top (isolate 0.254, rank 4, no thermals): 14.48,2.29 14.48,0.25 10.41,0.25 10.41,2.29 11.68,2.29
  pour Top (isolate 0.254, no thermals): 21.97,44.2 21.97,42.42 26.42,42.42 26.42,44.2
  pour Bottom (isolate 0.254, no thermals): 30.35,26.67 34.67,26.67 34.67,28.32 30.35,28.32
  pour Top (isolate 0.254, no thermals): 22.99,39.24 25.91,39.24 25.91,37.47 22.99,37.47
  pour Top (isolate 0.254, no thermals): 12.7,43.56 12.7,42.29 13.65,42.29 13.65,43.56
VDDA  (via drill 0.41)
  Top 0.33: X3.4 v21.53,43.82
  Bottom 0.61: v26.8,38.86 25.02,40.64 22.86,40.64 21.53,41.97 v21.53,43.82
  other vias: 26.8,37.97
  pour Bottom (isolate 0.254, rank 2, no thermals): 27.62,39.24 26.42,39.24 26.42,37.54 27.62,37.54
  pour Top (isolate 0.254, rank 2, no thermals): 26.42,37.54 30.35,37.54 30.35,38.42 27.62,38.42 27.62,39.24 26.42,39.24
VIN  (via drill 0.33)
  Bottom 1.016: JP2.7 22.99,4.06 21.08,2.16 v18.67,2.16 8.38,2.16 6.11,4.43 X4.1
  other vias: 19.43,2.16
  pour Top (isolate 0.254, no thermals): 16.89,0.25 16.89,1.52 18.41,1.52 18.41,3.45 19.68,3.45 19.68,0.25

### Text on the board
tPlace: P0 | SWO | RST | P1 | SWC | BOOT | P2 | SWD | SYN | P3 | RST | P9 | P4 | P8 | 3.3v | P5 | GND | P7 | P6 | VIN | 3.3V | GND
bPlace: https://openmv.io | OpenMV-H7 R1 | 10/27/18 | LED1=Red | LED2=Green | LED3=Blue | LED4=IR | Built by MacroFab | Made in USA | Pin List | P0=PB15/MOSI | P0 | P1=PB14/MISO | P2=PB13/SCLK | SWO | RST | P3=PB12/SS | P1 | P4=PB10/TXD/SCL | SWC | P5=PB11/RXD/SDA | BOOT | P2 | P6=PA5/ADC/DAC | SWD | SYN | P7=PD12/SERVO1 | P3 | P8=PD13/SERVO2 | RST | P9 | P9=PD14/SERVO3 | P4 | P8 | Max voltage: 5v | 3.3v | P5 | GND | P7 | P6 | VIN | 3.3V | GND